# EAGLE design sioCortex (EAGLE 5.08)
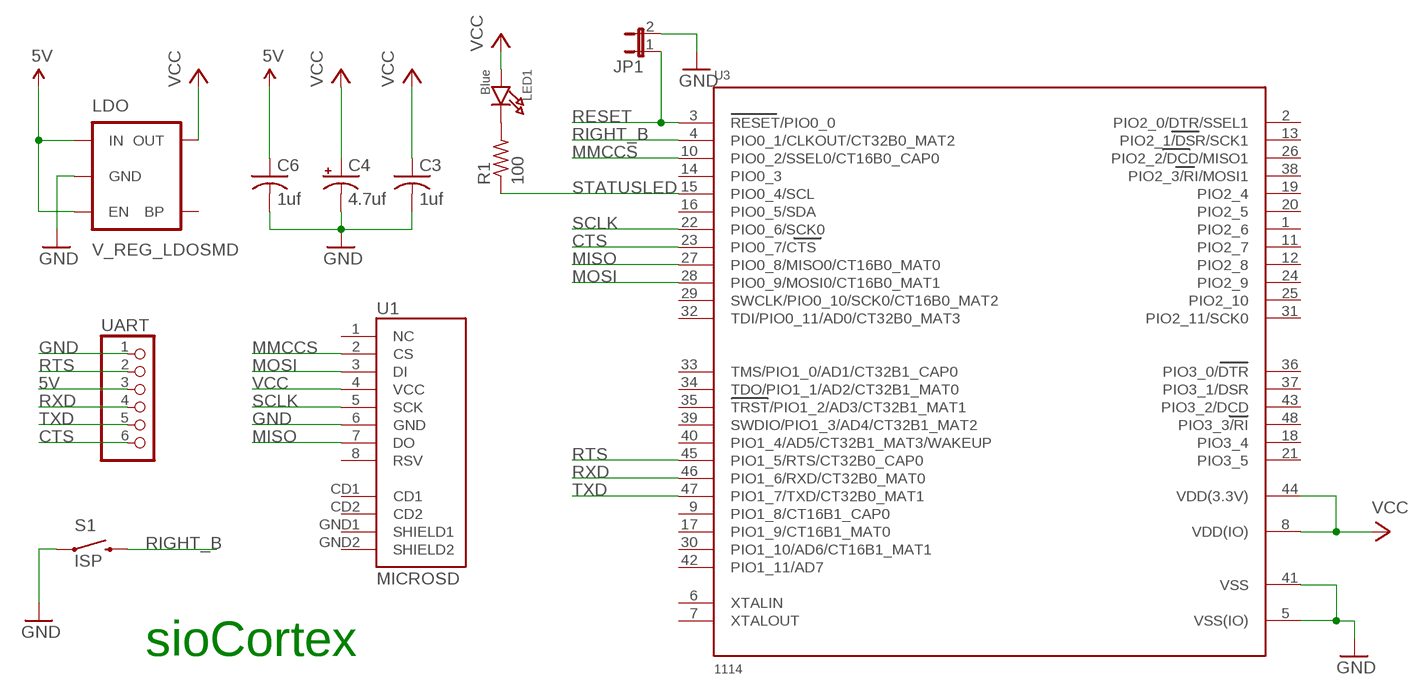
[diagram p0: schematic, sheet 1]

## Parts
C3  1uf  C-USC0805  [C0805]
C4  4.7uf  CAP_POL1206  [EIA3216]
C6  1uf  C-USC0805  [C0805]
JP1  JUMPER-2SMD-NO  [SJ_2S-NO]
LDO  V_REG_LDOSMD  [SOT23-5]
LED1  Blue  LED0805  [CHIPLED_0805]
R1  100  R-US_M0805  [M0805]
S1  ISP  SWITCH-MOMENTARY-2SMD-2  [TACTILE_SWITCH_SMD-2]
U1  MICROSD  USD-SOCKETNEW  [MICRO-SD-SOCKET-PP]
U3  1114  LPC1113/4  [LQFP48]
UART  HEADER-1X6ROUND  [1X06_ROUND]

## Nets
5V [power]: C6.1 LDO.1(IN) LDO.3(EN) UART.3
CTS: U3.23(PIO0_7/CTS) UART.6
GND [power]: C3.2 C4.C(-) C6.2 JP1.2 LDO.2(GND) S1.2 U1.6(GND) U3.5(VSS(IO)) U3.41(VSS) UART.1
MISO: U1.7(DO) U3.27(PIO0_8/MISO0/CT16B0_MAT0)
MMCCS: U1.2(CS) U3.10(PIO0_2/SSEL0/CT16B0_CAP0)
MOSI: U1.3(DI) U3.28(PIO0_9/MOSI0/CT16B0_MAT1)
N$4: LED1.C R1.2
RESET: JP1.1 U3.3(RESET/PIO0_0)
RIGHT_B: S1.1 U3.4(PIO0_1/CLKOUT/CT32B0_MAT2)
RTS: U3.45(PIO1_5/RTS/CT32B0_CAP0) UART.2
RXD: U3.46(PIO1_6/RXD/CT32B0_MAT0) UART.4
SCLK: U1.5(SCK) U3.22(PIO0_6/SCK0)
STATUSLED: R1.1 U3.15(PIO0_4/SCL)
TXD: U3.47(PIO1_7/TXD/CT32B0_MAT1) UART.5
VCC [power]: C3.1 C4.A(+) LDO.5(OUT) LED1.A U1.4(VCC) U3.8(VDD(IO)) U3.44(VDD(3.3V))
Unconnected: LDO.4(BP) U1.1(NC) U1.8(RSV) U1.CD1 U1.CD2 U1.GND1(SHIELD1) U1.GND2(SHIELD2) U3.1(PIO2_6) U3.2(PIO2_0/DTR/SSEL1) U3.6(XTALIN) U3.7(XTALOUT) U3.9(PIO1_8/CT16B1_CAP0) U3.11(PIO2_7) U3.12(PIO2_8) U3.13(PIO2_1/DSR/SCK1) U3.14(PIO0_3) U3.16(PIO0_5/SDA) U3.17(PIO1_9/CT16B1_MAT0) U3.18(PIO3_4) U3.19(PIO2_4) U3.20(PIO2_5) U3.21(PIO3_5) U3.24(PIO2_9) U3.25(PIO2_10) U3.26(PIO2_2/DCD/MISO1) U3.29(SWCLK/PIO0_10/SCK0/CT16B0_MAT2) U3.30(PIO1_10/AD6/CT16B1_MAT1) U3.31(PIO2_11/SCK0) U3.32(TDI/PIO0_11/AD0/CT32B0_MAT3) U3.33(TMS/PIO1_0/AD1/CT32B1_CAP0) U3.34(TDO/PIO1_1/AD2/CT32B1_MAT0) U3.35(TRST/PIO1_2/AD3/CT32B1_MAT1) U3.36(PIO3_0/DTR) U3.37(PIO3_1/DSR) U3.38(PIO2_3/RI/MOSI1) U3.39(SWDIO/PIO1_3/AD4/CT32B1_MAT2) U3.40(PIO1_4/AD5/CT32B1_MAT3/WAKEUP) U3.42(PIO1_11/AD7) U3.43(PIO3_2/DCD) U3.48(PIO3_3/RI)

## Notes on the sheet
- sioCortex

## Library data of the parts
C3 C6 = adafruit:C-US: CAPACITOR, American symbol
C4 = SparkFun:CAP_POL: Capacitor Polarized These are standard SMD and PTH capacitors. Normally 10uF, 47uF, and 100uF in electrolytic and tantalum varieties. Always verify the external diameter of the through hole cap, it varies with capacity, voltage, and manufacturer. The EIA devices should be standard.
JP1 = SparkFun:JUMPER-2: Jumper Basic 0.1" spaced jumper. Use with breakaway headers.
LDO = PeterAtMega644:V_REG_LDO: Voltage Regulator LDO Standard 150mA LDO voltage regulator in SOT-23 layout. Micrel part MIC5205. BP (by-pass) pin is used to lower output noise with 470pF cap.
LED1 = microbuilder:LED: LED 0603 - 0603 Surface Mount Package Green LED - Low Power (3.9mcd, 2ma, 1.7Vf) Orange LED - Low Power (9.8mcd, 2ma, 1.8Vf) Red LED - Low Power (5mcd, 2ma, 1.8Vf) Yellow LED - Low Power (7mcd, 2ma, 1.8Vf) 0805 - 0805 Surface Mount Package Red LED (104mcd, 20mA, Diffused) - LS R976 [Digikey: 475-1278-6-ND] Red LED (12mcd, 20mA, 2.0Vf, Clear) - APT2012EC [Digikey: 754-1128-1-ND] Red LED (8.8mcd, 2mA, 1.8Vf, Clear) - Low Power [Digikey: 475-2510-1-ND] Green LED (15mcd, 20mA, 2.2Vf, Clear) - APT2012GC [Digikey: 754-1131-1-ND] Green LED (5mcd, 2mA, 1.8Vf, Clear) - Low Power [Digikey: 475-2730-1-ND] Orange LED (160mcd, 20mA, 2.1Vf, Clear) - APT2012SECK [Digikey: 754-1130-1-ND] 1206 - 1206 Surface Mount Package Green LED (26mcd, 20mA, Diffused) - LG N971 [Digikey: 475-1407-6-ND] Red LED (15mcd, 20mA, Diffused) - LH N974 [Digikey: 475-1416-6-ND]
R1 = adafruit:R-US_: RESISTOR, American symbol
S1 = SparkFun:SWITCH-MOMENTARY-2
U1 = SparkFun:USD-SOCKET: microSD Socket Push-push type uSD socket. Schematic element and footprint production proven. Spark Fun Electronics SKU : PRT-00127. tDoc lines correctly indicate media card edge positions when inserting (unlocked, locked, depressed).
U3 = microbuilder:LPC1113/4: LPC1113/4 MCU QFP48 Package ARM Cortex M0, 50MHz Operation, 8 Channel 10-Bit ADC, 1²C, 2xSPI, UART, 2x16 Bit and 2x32 Bit Timers, Internal 12MHz Oscillator, 1.8-3.6V operation. Model Flash SRAM Part N°: Digikey Mouser LPC1113 24KB 8KB LPC1113FBD48/301 TBD TBD LPC1114 32KB 8KB LPC1114FBD48/301 568-4950-ND 771-LPC1114FBD483011
UART = microbuilder:HEADER-1X6: PIN HEADER

## Net classes
0 default: width 0.203 mm, drill 0.305 mm, clearance 0.203 mm
1 power: width 0.203 mm, drill 0.305 mm, clearance 0.203 mm

## Board
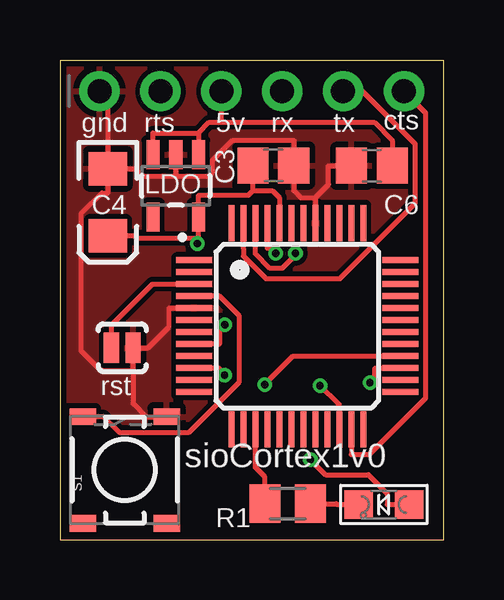
[diagram p1: board, top side]
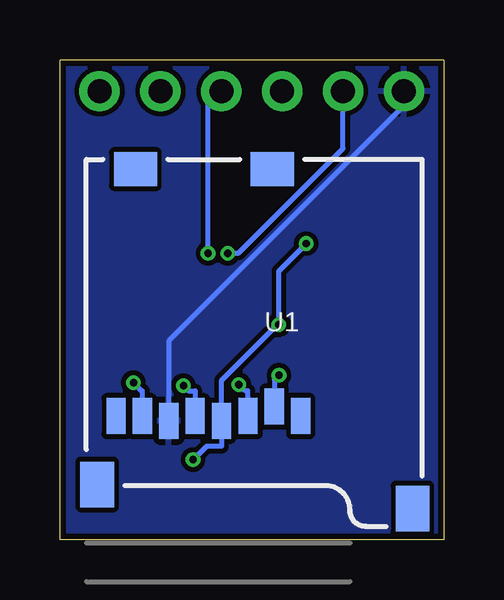
[diagram p2: board, bottom side, seen from below]

Size 16 x 20 mm. Coordinates in mm from the lower left corner, seen from the top.
Outline: 0,0 16,0 16,20 0,20 0,0
Copper layers (1*16): Top 0.035mm / dielectric 1.5mm / Bottom 0.035mm
Design rules "Fusion_eagle_rule_v1.1": minimum track width 6mil, minimum drill 12mil, track to track 6mil, track to pad 6mil, pad to pad 6mil, via to via 6mil, smd to smd 0mil, copper to edge 10mil, drill to drill 10mil, minimum pad ring 10mil, minimum via ring 6mil, stop-mask expansion 2mil, vias tented up to drill 100mil, thermal gap 10mil

### Footprints (pad centres in the part's own frame; a part is rotated, then mirrored left to right if it is on the bottom)
C0805 = smd 1.3 x 1.5: 1 -0.85,0; 2 0.85,0
EIA3216 = smd 1.4 x 1.6: A 1.4,0; C -1.4,0
SJ_2S-NO = smd 0.635 x 1.27: 1 -0.45,0; 2 0.45,0
SOT23-5 = smd 0.55 x 1.2: 1 -0.95,-1.3; 2 0,-1.3; 3 0.95,-1.3; 4 0.95,1.3; 5 -0.95,1.3
CHIPLED_0805 = smd 1.2 x 1.2: A 0,-1.05; C 0,1.05
M0805 = smd 1.3 x 1.6: 1 -0.95,0; 2 0.95,0
TACTILE_SWITCH_SMD-2 = smd 0.7 x 1.1: 1 2.225,1.75; 2 2.225,-1.75; 3 -2.225,-1.75; 4 -2.225,1.75
MICRO-SD-SOCKET-PP = smd 0.8 x 1.5: 1 -8.94,10.7; 2 -7.84,10.3; 3 -6.74,10.7; 4 -5.64,10.9; 5 -4.54,10.7; 6 -3.44,10.9; 7 -2.34,10.7; 8 -1.24,10.7 | smd 1.4 x 1.9: CD1 -0.45,13.55; GND1 -13.6,14.55 | smd 1.8 x 1.4: CD2 -2.05,0.4; GND2 -7.75,0.4
LQFP48 = smd 1.5 x 0.25: 1 -4.3,2.75; 2 -4.3,2.25; 3 -4.3,1.75; 4 -4.3,1.25; 5 -4.3,0.75; 6 -4.3,0.25; 7 -4.3,-0.25; 8 -4.3,-0.75; 9 -4.3,-1.25; 10 -4.3,-1.75; 11 -4.3,-2.25; 12 -4.3,-2.75; 25 4.3,-2.75; 26 4.3,-2.25; 27 4.3,-1.75; 28 4.3,-1.25; 29 4.3,-0.75; 30 4.3,-0.25; 31 4.3,0.25; 32 4.3,0.75; 33 4.3,1.25; 34 4.3,1.75; 35 4.3,2.25; 36 4.3,2.75 | smd 0.25 x 1.5: 13 -2.75,-4.3; 14 -2.25,-4.3; 15 -1.75,-4.3; 16 -1.25,-4.3; 17 -0.75,-4.3; 18 -0.25,-4.3; 19 0.25,-4.3; 20 0.75,-4.3; 21 1.25,-4.3; 22 1.75,-4.3; 23 2.25,-4.3; 24 2.75,-4.3; 37 2.75,4.3; 38 2.25,4.3; 39 1.75,4.3; 40 1.25,4.3; 41 0.75,4.3; 42 0.25,4.3; 43 -0.25,4.3; 44 -0.75,4.3; 45 -1.25,4.3; 46 -1.75,4.3; 47 -2.25,4.3; 48 -2.75,4.3
1X06_ROUND = drill 1 pad 1.676 round: 1 -6.35,0; 2 -3.81,0; 3 -1.27,0; 4 1.27,0; 5 3.81,0; 6 6.35,0

### Placement (x,y rotation side)
C3  8.9,15.6 0 top
C4  2,14.06 270 top
C6  13.01,15.59 180 top
JP1  2.6,8 0 top
LDO  4.83,14.75 180 top
LED1  13.51,1.46 90 top
R1  9.5,1.5 0 top
S1  2.7,2.9 90 top
U1  14.9,15.85 180 bottom
U3  9.9,8.9 0 top
UART  8,18.7 0 top

### Tracks (layer width: path | path; a pad name or v marks a point on that pad's centre or on a via)
5V
  Top 0.203: 6.73,17.4 13.11,17.4 13.86,16.64 C6.1 | 5.78,16.96 6.22,17.4 6.73,17.4 | 6.73,17.4 UART.3 | LDO.3 3.88,16.96 5.78,16.96 | 5.78,16.96 LDO.1
CTS
  Top 0.203: U3.23 12.15,3.54 12.9,3.54 15.26,5.9 15.26,17.79 UART.6
GND
  Top 0.203: UART.1 2,18.35 C4.C | C6.2 11.21,15.59 11.21,14.81 10.65,14.26 | 10.65,14.26 U3.41 | 10.65,14.26 10.04,14.26 9.75,14.54 C3.2 9.75,16.66 7.2,16.66 6.36,15.81 6.36,15.31 6.2,15.15 4.83,15.15 | 4.83,15.15 3.42,15.15 3.11,15.46 C4.C | 3.05,7.06 1.71,7.06 0.9,7.87 0.9,13.6 1.75,14.46 2,14.46 C4.C | 3.05,7.06 3.05,5.67 3.6,5.12 S1.2 | 4.83,15.15 LDO.2 | U3.5 4.54,9.65 4.54,8.87 3.67,8 JP1.2 3.05,7.06
  Bottom 0.203: UART.1 1.65,18.09 11.46,8.28 U1.6
  pour Top: 0,0 16,0 16,20 0,20
  pour Bottom: 0,0 16,0 16,20 0,20
MISO  (via drill 0.3 pad 0.61)
  Top 0.203: v12.93,6.54 13.14,6.75 13.14,7.15 U3.27
  Bottom 0.203: v12.93,6.54 12.6,6.21 12.56,6.21 U1.7
MMCCS  (via drill 0.3 pad 0.61)
  Top 0.203: v6.87,6.85 6.66,7.06 6.66,7.15 U3.10
  Bottom 0.203: U1.2 7.06,6.66 v6.87,6.85
MOSI  (via drill 0.3 pad 0.61)
  Top 0.203: U3.28 9.72,7.65 v8.54,6.46
  Bottom 0.203: U1.3 8.16,6.21 8.28,6.21 v8.54,6.46
N$4
  Top 0.203: LED1.C 11.55,1.46 11.52,1.5 R1.2
RESET
  Top 0.203: JP1.1 2.15,8.94 3.86,10.65 U3.3
RIGHT_B
  Top 0.203: S1.1 1.8,5.12 2.46,4.47 5.38,4.47 7.48,6.58 7.48,9.32 6.66,10.15 U3.4
RTS  (via drill 0.3 pad 0.61)
  Top 0.203: v9,11.94 8.79,12.14 8.65,12.14 U3.45
  Bottom 0.203: UART.2 4.19,16.31 8.56,11.94 v9,11.94
RXD  (via drill 0.3 pad 0.61)
  Top 0.203: U3.46 8.15,11.92 8.77,11.31 9.27,11.31 9.82,11.86 v9.82,11.93
  Bottom 0.203: UART.4 9.82,18.15 v9.82,11.93
SCLK  (via drill 0.3 pad 0.61)
  Top 0.203: v10.85,6.41 11.61,5.66 11.65,5.66 U3.22
  Bottom 0.203: U1.5 10.36,6.21 10.64,6.21 v10.85,6.41
STATUSLED
  Top 0.203: R1.1 8.55,2.6 8.15,3 U3.15
TXD
  Top 0.203: UART.5 12.62,18.7 14.82,16.5 14.82,14.02 11.68,10.88 8.59,10.88 7.65,11.82 7.65,12.14 U3.47
VCC  (via drill 0.3 pad 0.61)
  Top 0.203: 8.05,14.54 7.86,14.36 5.78,14.36 LDO.5 5.78,13 5.78,12.55 5.72,12.55 | 8.05,14.54 C3.1 | U3.44 9.15,14.26 8.86,14.54 8.05,14.54 | LED1.A 13.65,1.46 13.65,1.92 12.87,2.7 11.08,2.7 v10.45,3.33 | U3.8 6.66,8.15 6.66,8.74 v6.87,8.95 | v5.72,12.34 5.72,12.55 | 5.72,12.55 3.22,12.55 3.11,12.66 C4.A
  Bottom 0.203: v10.45,3.33 9.88,3.9 9.26,3.9 U1.4 9.26,6.64 6.94,8.95 v6.87,8.95 6.87,11.2 v5.72,12.34

### Text on the board
tPlace: gnd | rts | 5v | rx | tx | cts | sioCortex1v0
tNames: rst